# Altium schematic sheet VGA.SchDoc
size 594 x 420 mm
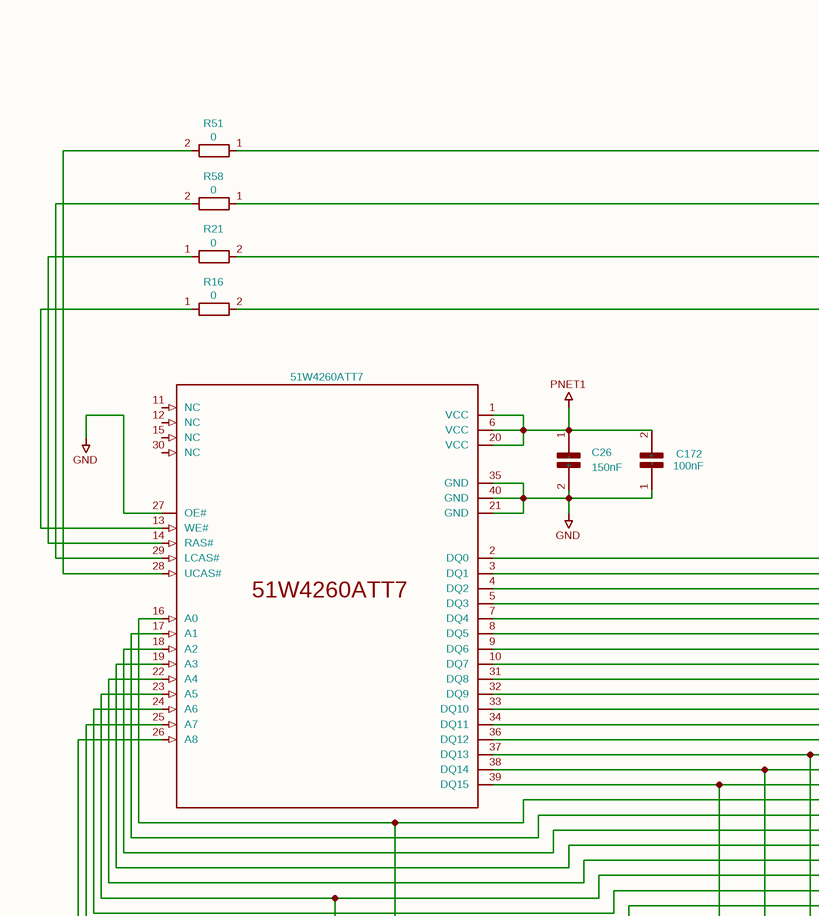
[diagram p0: VGA.SchDoc, top left]
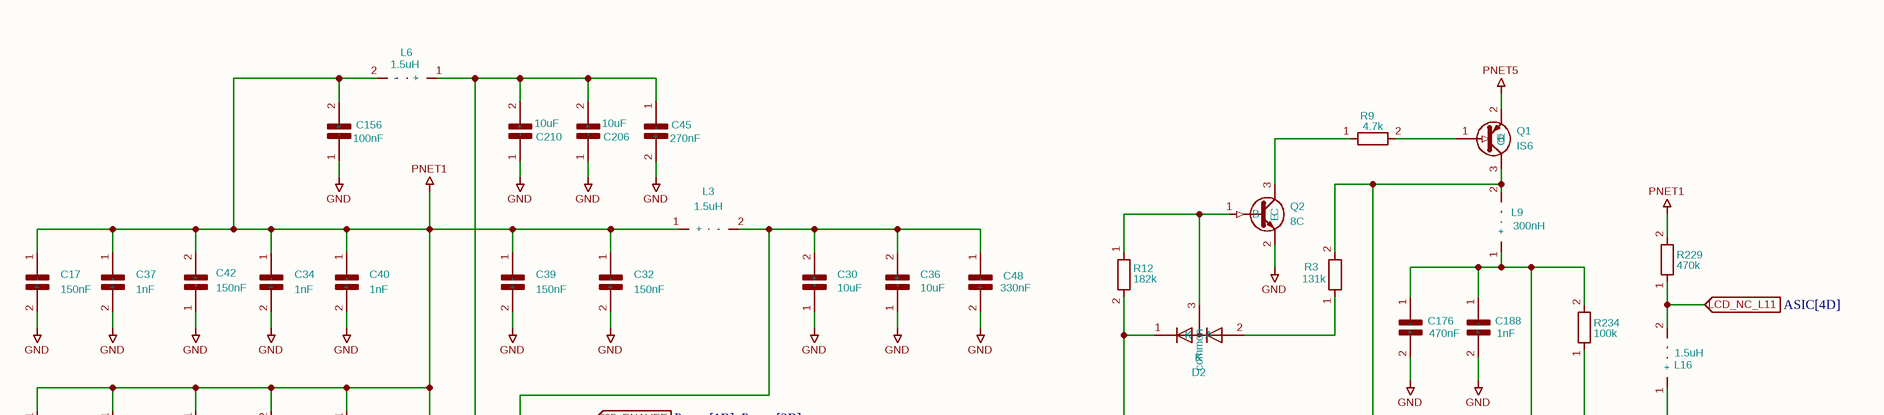
[diagram p1: VGA.SchDoc, top right]
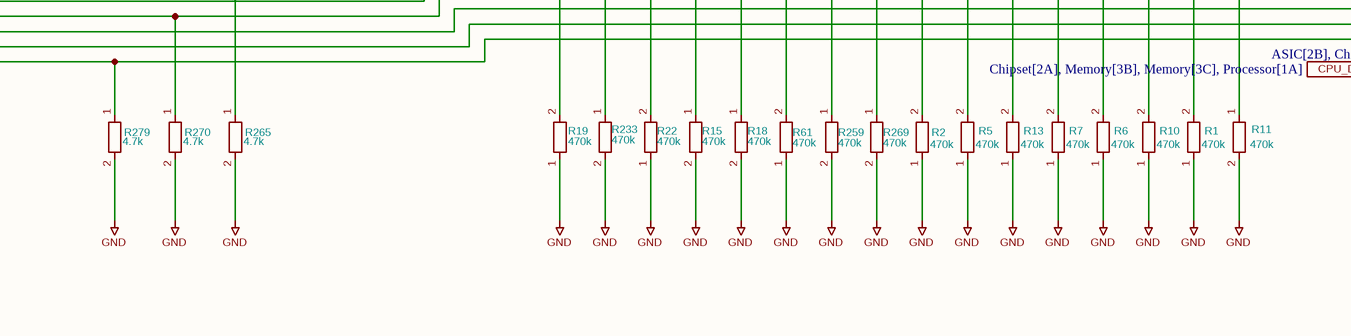
[diagram p2: VGA.SchDoc, bottom left]
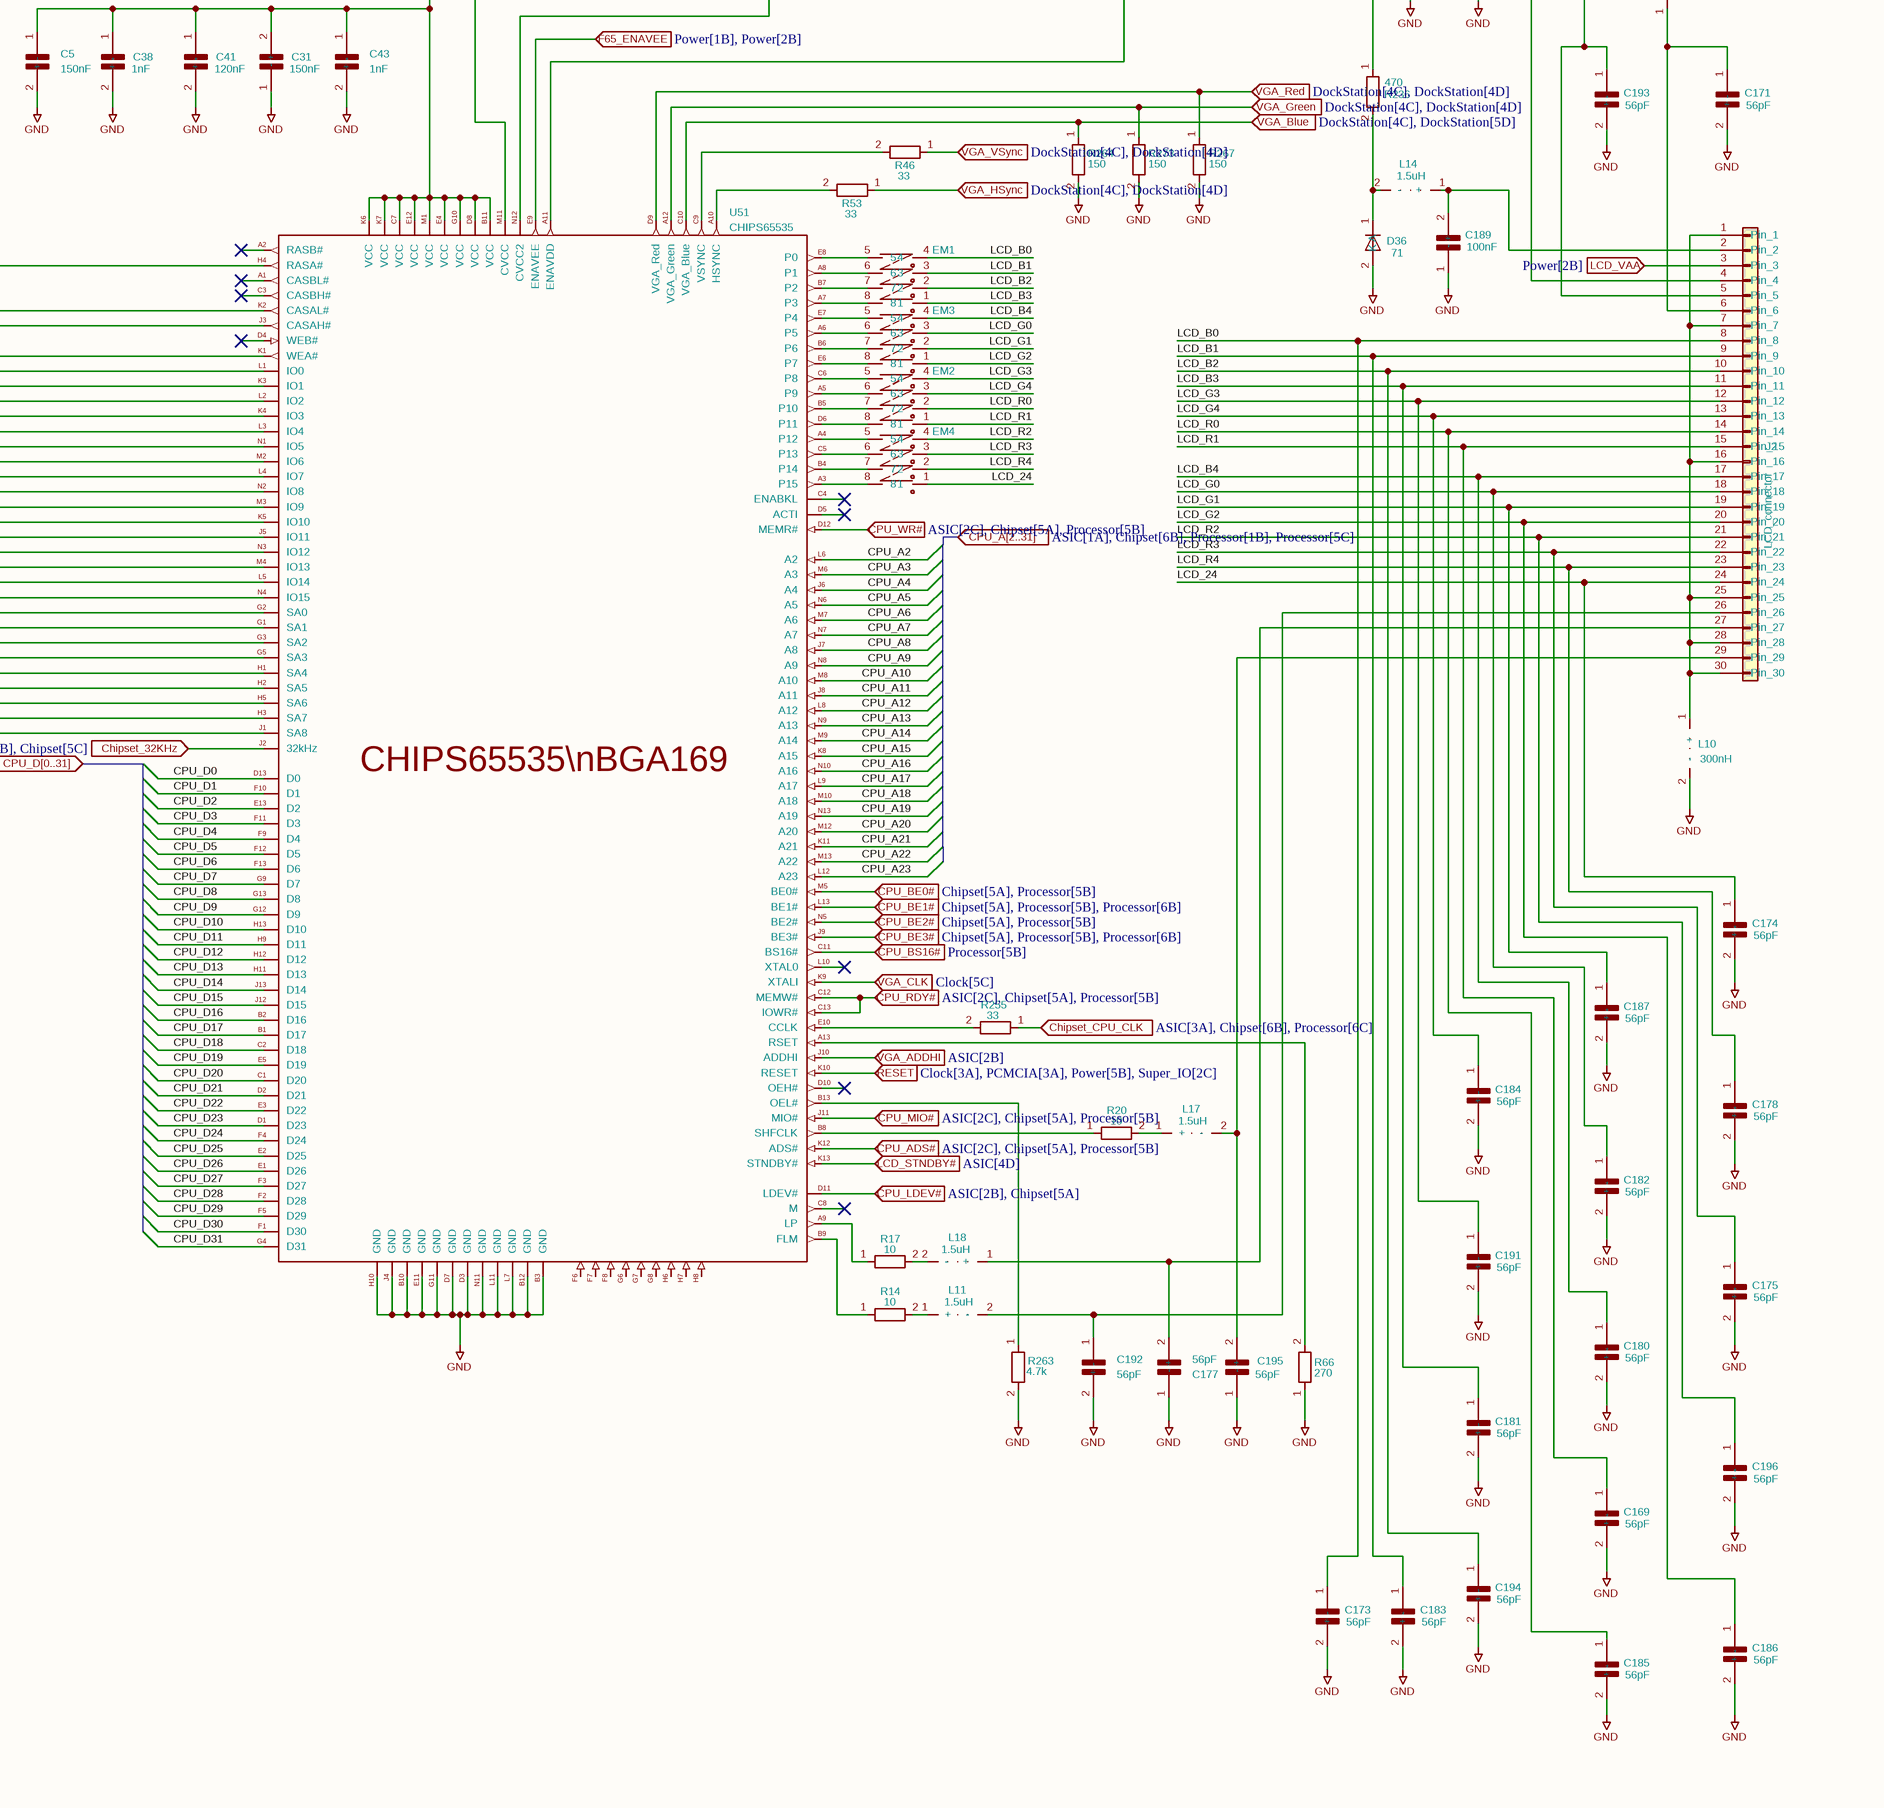
[diagram p3: VGA.SchDoc, bottom right]

## Parts
C5  150nF  [C_0402_1005Metric]
C17  150nF  [C_0402_1005Metric]
C26  150nF  [C_0402_1005Metric]
C30  10uF  [C_1206_3216Metric]
C31  150nF  [C_0402_1005Metric]
C32  150nF  [C_0402_1005Metric]
C34  1nF  [C_0402_1005Metric]
C36  10uF  [C_1206_3216Metric]
C37  1nF  [C_0402_1005Metric]
C38  1nF  [C_0402_1005Metric]
C39  150nF  [C_0402_1005Metric]
C40  1nF  [C_0402_1005Metric]
C41  120nF  [C_0402_1005Metric]
C42  150nF  [C_0402_1005Metric]
C43  1nF  [C_0402_1005Metric]
C45  270nF  [C_0603_1608Metric]
C48  330nF  [C_0402_1005Metric]
C156  100nF  [C_0402_1005Metric]
C169  56pF  [C_0402_1005Metric]
C171  56pF  [C_0402_1005Metric]
C172  100nF  [C_0402_1005Metric]
C173  56pF  [C_0402_1005Metric]
C174  56pF  [C_0402_1005Metric]
C175  56pF  [C_0402_1005Metric]
C176  470nF  [C_0603_1608Metric]
C177  56pF  [C_0402_1005Metric]
C178  56pF  [C_0402_1005Metric]
C180  56pF  [C_0402_1005Metric]
C181  56pF  [C_0402_1005Metric]
C182  56pF  [C_0402_1005Metric]
C183  56pF  [C_0402_1005Metric]
C184  56pF  [C_0402_1005Metric]
C185  56pF  [C_0402_1005Metric]
C186  56pF  [C_0402_1005Metric]
C187  56pF  [C_0402_1005Metric]
C188  1nF  [C_0402_1005Metric]
C189  100nF  [C_0402_1005Metric]
C191  56pF  [C_0402_1005Metric]
C192  56pF  [C_0402_1005Metric]
C193  56pF  [C_0402_1005Metric]
C194  56pF  [C_0402_1005Metric]
C195  56pF  [C_0402_1005Metric]
C196  56pF  [C_0402_1005Metric]
C206  10uF  [C_1206_3216Metric]
C210  10uF  [C_1206_3216Metric]
D2  K  [SOT-416L]
D36  71  [D_0603_1608Metric]
EM1  R-array  [R-array]  (value not drawn)
EM2  R-array  [R-array]  (value not drawn)
EM3  R-array  [R-array]  (value not drawn)
EM4  R-array  [R-array]  (value not drawn)
J2  LCD_connector  [LCD_connector]
L3  1.5uH  [L_0603_1608Metric]
L6  1.5uH  [L_0603_1608Metric]
L9  300nH  [L_0805_2012Metric]
L10  300nH  [L_0805_2012Metric]
L11  1.5uH  [L_0603_1608Metric]
L14  1.5uH  [L_0603_1608Metric]
L16  1.5uH  [L_0603_1608Metric]
L17  1.5uH  [L_0603_1608Metric]
L18  1.5uH  [L_0603_1608Metric]
Q1  IS6  [SOT-23]
Q2  8C  [SOT-416]
R1  470k  [R_0402_1005Metric]
R2  470k  [R_0402_1005Metric]
R3  131k  [R_0402_1005Metric]
R5  470k  [R_0402_1005Metric]
R6  470k  [R_0402_1005Metric]
R7  470k  [R_0402_1005Metric]
R9  4.7k  [R_0402_1005Metric]
R10  470k  [R_0402_1005Metric]
R11  470k  [R_0402_1005Metric]
R12  182k  [R_0402_1005Metric]
R13  470k  [R_0402_1005Metric]
R14  10  [R_0402_1005Metric]
R15  470k  [R_0402_1005Metric]
R16  0  [R_0402_1005Metric]
R17  10  [R_0402_1005Metric]
R18  470k  [R_0402_1005Metric]
R19  470k  [R_0402_1005Metric]
R20  10  [R_0402_1005Metric]
R21  0  [R_0402_1005Metric]
R22  470k  [R_0402_1005Metric]
R46  33  [R_0402_1005Metric]
R51  0  [R_0402_1005Metric]
R53  33  [R_0402_1005Metric]
R58  0  [R_0402_1005Metric]
R61  470k  [R_0402_1005Metric]
R66  270  [R_0402_1005Metric]
R229  470k  [R_0402_1005Metric]
R233  470k  [R_0402_1005Metric]
R234  100k  [R_0402_1005Metric]
R236  470  [R_0402_1005Metric]
R255  33  [R_0402_1005Metric]
R259  470k  [R_0402_1005Metric]
R263  4.7k  [R_0402_1005Metric]
R264  150  [R_0805_2012Metric]
R265  4.7k  [R_0402_1005Metric]
R267  150  [R_0805_2012Metric]
R269  470k  [R_0402_1005Metric]
R270  4.7k  [R_0402_1005Metric]
R273  150  [R_0805_2012Metric]
R279  4.7k  [R_0402_1005Metric]
U8  51W4260ATT7  [GRAMchip]
U51  CHIPS65535  [BGA-169]

## Ports
Chipset_32KHz (in, see ASIC[2B], Chipset[5C]), Chipset_CPU_CLK (in, see ASIC[3A], Chipset[6B], Processor[6C]), CPU_A[2..31] (in, see ASIC[1A], Chipset[6B], Processor[1B], Processor[5C]), CPU_ADS# (in, see ASIC[2C], Chipset[5A], Processor[5B]), CPU_BE0# (in, see Chipset[5A], Processor[5B]), CPU_BE1# (in, see Chipset[5A], Processor[5B], Processor[6B]), CPU_BE2# (in, see Chipset[5A], Processor[5B]), CPU_BE3# (in, see Chipset[5A], Processor[5B], Processor[6B]), CPU_BS16# (in, see Processor[5B]), CPU_D[0..31] (in, see Chipset[2A], Memory[3B], Memory[3C], Processor[1A]), CPU_LDEV# (in, see ASIC[2B], Chipset[5A]), CPU_MIO# (in, see ASIC[2C], Chipset[5A], Processor[5B]), CPU_RDY# (in, see ASIC[2C], Chipset[5A], Processor[5B]), CPU_WR# (in, see ASIC[2C], Chipset[5A], Processor[5B]), F65_ENAVEE (in, see Power[1B], Power[2B]), LCD_NC_L11 (in, see ASIC[4D]), LCD_STNDBY# (in, see ASIC[4D]), LCD_VAA (in, see Power[2B]), RESET (in, see Clock[3A], PCMCIA[3A], Power[5B], Super_IO[2C]), VGA_ADDHI (in, see ASIC[2B]), VGA_Blue (in, see DockStation[4C], DockStation[5D]), VGA_CLK (in, see Clock[5C]), VGA_Green (in, see DockStation[4C], DockStation[4D]), VGA_HSync (in, see DockStation[4C], DockStation[4D]), VGA_Red (in, see DockStation[4C], DockStation[4D]), VGA_VSync (in, see DockStation[4C], DockStation[4D])

## Nets
GND: C5.2(-) C17.2(-) C26.2(-) C30.1(+) C31.1(+) C32.2(-) C34.2(-) C36.1(+) C37.2(-) C38.2(-) C39.2(-) C40.2(-) C41.2(-) C42.1(+) C43.2(-) C45.2(-) C48.2(-) C156.1(+) C169.2(-) C171.2(-) C172.1(+) C173.2(-) C174.2(-) C175.2(-) C176.2(-) C177.1(+) C178.2(-) C180.2(-) C181.2(-) C182.2(-) C183.2(-) C184.2(-) C185.2(-) C186.2(-) C187.2(-) C188.2(-) C189.1(+) C191.2(-) C192.2(-) C193.2(-) C194.2(-) C195.1(+) C196.2(-) C206.1(+) C210.1(+) D36.2(A) L10.2(-) Q2.2(E) R1.1 R2.1 R5.1 R6.1 R7.1 R10.1 R11.2 R13.1 R15.2 R18.2 R19.1 R22.1 R61.1 R66.1 R233.2 R259.2 R263.2 R264.2 R265.2 R267.2 R269.2 R270.2 R273.2 R279.2 U8.21(GND) U8.27(OE#) U8.35(GND) U8.40(GND) U51.B3(GND) U51.B10(GND) U51.B12(GND) U51.D3(GND) U51.D7(GND) U51.E11(GND) U51.G11(GND) U51.H10(GND) U51.J4(GND) U51.L7(GND) U51.L11(GND) U51.N11(GND)
PNET1: C5.1(+) C17.1(+) C26.1(+) C31.2(-) C32.1(+) C34.1(+) C37.1(+) C38.1(+) C39.1(+) C40.1(+) C41.1(+) C42.2(-) C43.1(+) C156.2(-) C172.2(-) L3.1(+) L6.2(-) R229.2 U8.1(VCC) U8.6(VCC) U8.20(VCC) U51.B11(VCC) U51.C7(VCC) U51.D8(VCC) U51.E4(VCC) U51.E12(VCC) U51.G10(VCC) U51.K6(VCC) U51.K7(VCC) U51.M1(VCC)
PNET5: Q1.2(E)
Chipset_32KHz: U51.J2(32kHz) ; port Chipset_32KHz
Chipset_CPU_CLK: R255.1 ; port Chipset_CPU_CLK
CPU_A2: U51.L6(A2)
CPU_A3: U51.M6(A3)
CPU_A4: U51.J6(A4)
CPU_A5: U51.N6(A5)
CPU_A6: U51.M7(A6)
CPU_A7: U51.N7(A7)
CPU_A8: U51.J7(A8)
CPU_A9: U51.N8(A9)
CPU_A10: U51.M8(A10)
CPU_A11: U51.J8(A11)
CPU_A12: U51.L8(A12)
CPU_A13: U51.N9(A13)
CPU_A14: U51.M9(A14)
CPU_A15: U51.K8(A15)
CPU_A16: U51.N10(A16)
CPU_A17: U51.L9(A17)
CPU_A18: U51.M10(A18)
CPU_A19: U51.N13(A19)
CPU_A20: U51.M12(A20)
CPU_A21: U51.K11(A21)
CPU_A22: U51.M13(A22)
CPU_A23: U51.L12(A23)
CPU_ADS#: U51.K12(ADS#) ; port CPU_ADS#
CPU_BE0#: U51.M5(BE0#) ; port CPU_BE0#
CPU_BE1#: U51.L13(BE1#) ; port CPU_BE1#
CPU_BE2#: U51.N5(BE2#) ; port CPU_BE2#
CPU_BE3#: U51.J9(BE3#) ; port CPU_BE3#
CPU_BS16#: U51.C11(BS16#) ; port CPU_BS16#
CPU_D0: U51.D13(D0)
CPU_D1: U51.F10(D1)
CPU_D2: U51.E13(D2)
CPU_D3: U51.F11(D3)
CPU_D4: U51.F9(D4)
CPU_D5: U51.F12(D5)
CPU_D6: U51.F13(D6)
CPU_D7: U51.G9(D7)
CPU_D8: U51.G13(D8)
CPU_D9: U51.G12(D9)
CPU_D10: U51.H13(D10)
CPU_D11: U51.H9(D11)
CPU_D12: U51.H12(D12)
CPU_D13: U51.H11(D13)
CPU_D14: U51.J13(D14)
CPU_D15: U51.J12(D15)
CPU_D16: U51.B2(D16)
CPU_D17: U51.B1(D17)
CPU_D18: U51.C2(D18)
CPU_D19: U51.E5(D19)
CPU_D20: U51.C1(D20)
CPU_D21: U51.D2(D21)
CPU_D22: U51.E3(D22)
CPU_D23: U51.D1(D23)
CPU_D24: U51.F4(D24)
CPU_D25: U51.E2(D25)
CPU_D26: U51.E1(D26)
CPU_D27: U51.F3(D27)
CPU_D28: U51.F2(D28)
CPU_D29: U51.F5(D29)
CPU_D30: U51.F1(D30)
CPU_D31: U51.G4(D31)
CPU_LDEV#: U51.D11(LDEV#) ; port CPU_LDEV#
CPU_MIO#: U51.J11(MIO#) ; port CPU_MIO#
CPU_RDY#: U51.C12(MEMW#) U51.C13(IOWR#) ; port CPU_RDY#
CPU_WR#: U51.D12(MEMR#) ; port CPU_WR#
F65_ENAVEE: U51.E9(ENAVEE) ; port F65_ENAVEE
LCD_24: C174.1(+) EM4.1 J2.24(Pin_24)
LCD_B0: C173.1(+) EM1.4 J2.8(Pin_8)
LCD_B1: C183.1(+) EM1.3 J2.9(Pin_9)
LCD_B2: C194.1(+) EM1.2 J2.10(Pin_10)
LCD_B3: C181.1(+) EM1.1 J2.11(Pin_11)
LCD_B4: C180.1(+) EM3.4 J2.17(Pin_17)
LCD_G0: C182.1(+) EM3.3 J2.18(Pin_18)
LCD_G1: C187.1(+) EM3.2 J2.19(Pin_19)
LCD_G2: C186.1(+) EM3.1 J2.20(Pin_20)
LCD_G3: C191.1(+) EM2.4 J2.12(Pin_12)
LCD_G4: C184.1(+) EM2.3 J2.13(Pin_13)
LCD_NC_L11: L16.2(-) R229.1 ; port LCD_NC_L11
LCD_R0: C185.1(+) EM2.2 J2.14(Pin_14)
LCD_R1: C169.1(+) EM2.1 J2.15(Pin_15)
LCD_R2: C196.1(+) EM4.4 J2.21(Pin_21)
LCD_R3: C175.1(+) EM4.3 J2.22(Pin_22)
LCD_R4: C178.1(+) EM4.2 J2.23(Pin_23)
LCD_STNDBY#: U51.K13(STNDBY#) ; port LCD_STNDBY#
LCD_VAA: J2.3(Pin_3) ; port LCD_VAA
RESET: U51.K10(RESET) ; port RESET
VGA_ADDHI: U51.J10(ADDHI) ; port VGA_ADDHI
VGA_Blue: R264.1 U51.C10(VGA_Blue) ; port VGA_Blue
VGA_CLK: U51.K9(XTALI) ; port VGA_CLK
VGA_Green: R273.1 U51.A12(VGA_Green) ; port VGA_Green
VGA_HSync: R53.1 ; port VGA_HSync
VGA_Red: R267.1 U51.D9(VGA_Red) ; port VGA_Red
VGA_VSync: R46.1 ; port VGA_VSync
NetC30_2: C30.2(-) C36.2(-) C48.1(+) L3.2(-) U51.N12(CVCC2)
NetC45_1: C45.1(+) C206.2(-) C210.2(-) L6.1(+) U51.M11(CVCC)
NetC171_1: C171.1(+) J2.6(Pin_6) L16.1(+)
NetC176_1: C176.1(+) C188.1(+) J2.4(Pin_4) L9.1(+) R234.2
NetC177_2: C177.2(-) J2.27(Pin_27) L18.1(+)
NetC189_2: C189.2(-) J2.2(Pin_2) L14.1(+)
NetC192_1: C192.1(+) J2.26(Pin_26) L11.2(-)
NetC193_1: C193.1(+) J2.5(Pin_5) R234.1
NetC195_2: C195.2(-) J2.29(Pin_29) L17.2(-)
NetD2_1: D2.1(K) R12.2 U51.A11(ENAVDD)
NetD2_2: D2.2(A) R3.1
NetD2_3: D2.3(common) Q2.1(B) R12.1
NetD36_1: D36.1(K) L14.2(-) R236.2
NetEM1_5: EM1.5 U51.E8(P0)
NetEM1_6: EM1.6 U51.A8(P1)
NetEM1_7: EM1.7 U51.B7(P2)
NetEM1_8: EM1.8 U51.A7(P3)
NetEM2_5: EM2.5 U51.C6(P8)
NetEM2_6: EM2.6 U51.A5(P9)
NetEM2_7: EM2.7 U51.B5(P10)
NetEM2_8: EM2.8 U51.D6(P11)
NetEM3_5: EM3.5 U51.E7(P4)
NetEM3_6: EM3.6 U51.A6(P5)
NetEM3_7: EM3.7 U51.B6(P6)
NetEM3_8: EM3.8 U51.E6(P7)
NetEM4_5: EM4.5 U51.A4(P12)
NetEM4_6: EM4.6 U51.C5(P13)
NetEM4_7: EM4.7 U51.B4(P14)
NetEM4_8: EM4.8 U51.A3(P15)
NetJ2_1: J2.1(Pin_1) J2.7(Pin_7) J2.16(Pin_16) J2.25(Pin_25) J2.28(Pin_28) J2.30(Pin_30) L10.1(+)
NetL9_2: L9.2(-) Q1.3(C) R3.2 R236.1
NetL11_1: L11.1(+) R14.2
NetL17_1: L17.1(+) R20.2
NetL18_2: L18.2(-) R17.2
NetQ1_1: Q1.1(B) R9.2
NetQ2_3: Q2.3(C) R9.1
NetR1_2: R1.2 U8.3(DQ1) U51.K3(IO1)
NetR2_2: R2.2 U8.10(DQ7) U51.L4(IO7)
NetR5_2: R5.2 U8.9(DQ6) U51.M2(IO6)
NetR6_2: R6.2 U8.5(DQ3) U51.K4(IO3)
NetR7_2: R7.2 U8.7(DQ4) U51.L3(IO4)
NetR10_2: R10.2 U8.4(DQ2) U51.L2(IO2)
NetR11_1: R11.1 U8.2(DQ0) U51.L1(IO0)
NetR13_2: R13.2 U8.8(DQ5) U51.N1(IO5)
NetR14_1: R14.1 U51.B9(FLM)
NetR15_1: R15.1 U8.36(DQ12) U51.N3(IO12)
NetR16_1: R16.1 U8.13(WE#)
NetR16_2: R16.2 U51.K1(WEA#)
NetR17_1: R17.1 U51.A9(LP)
NetR18_1: R18.1 U8.34(DQ11) U51.J5(IO11)
NetR19_2: R19.2 U8.39(DQ15) U51.N4(IO15)
NetR20_1: R20.1 U51.B8(SHFCLK)
NetR21_1: R21.1 U8.14(RAS#)
NetR21_2: R21.2 U51.H4(RASA#)
NetR22_2: R22.2 U8.37(DQ13) U51.M4(IO13)
NetR46_2: R46.2 U51.C9(VSYNC)
NetR51_1: R51.1 U51.J3(CASAH#)
NetR51_2: R51.2 U8.28(UCAS#)
NetR53_2: R53.2 U51.A10(HSYNC)
NetR58_1: R58.1 U51.K2(CASAL#)
NetR58_2: R58.2 U8.29(LCAS#)
NetR61_2: R61.2 U8.33(DQ10) U51.K5(IO10)
NetR66_2: R66.2 U51.A13(RSET)
NetR233_1: R233.1 U8.38(DQ14) U51.L5(IO14)
NetR255_2: R255.2 U51.E10(CCLK)
NetR259_1: R259.1 U8.32(DQ9) U51.M3(IO9)
NetR263_1: R263.1 U51.B13(OEL#)
NetR265_1: R265.1 U8.16(A0) U51.G2(SA0)
NetR269_1: R269.1 U8.31(DQ8) U51.N2(IO8)
NetR270_1: R270.1 U8.23(A5) U51.H2(SA5)
NetR279_1: R279.1 U8.26(A8) U51.J1(SA8)
NetU8_17: U8.17(A1) U51.G1(SA1)
NetU8_18: U8.18(A2) U51.G3(SA2)
NetU8_19: U8.19(A3) U51.G5(SA3)
NetU8_22: U8.22(A4) U51.H1(SA4)
NetU8_24: U8.24(A6) U51.H5(SA6)
NetU8_25: U8.25(A7) U51.H3(SA7)

Not connected (* = marked no-connect by the designer): U8 11(NC) 12(NC) 15(NC) 30(NC); U51 A1(CASBL#)* A2(RASB#)* C3(CASBH#)* C4(ENABKL)* C8(M)* D4(WEB#)* D5(ACTI)* D10(OEH#)* F6 F7 F8 G6 G7 G8 H6 H7 H8 L10(XTAL0)*

## Notes on the sheet
- 1
- 2
- 3
- 4
- 5
- 6
- 7
- 8
- 9
- 10
- 11
- A
- B
- C
- D
- E
- F
- G
- H
- Title: PC110
- File: VGA.kicad_sch
- Sheet: /
- Recreated by: Ahmad Byagowi
- KiCad E.D.A.  kicad (5.1.4)-1
- Size: A2
- Date:
- Rev:
- Id: 1/1
- (in symbol 65535) CHIPS65535\nBGA169

## Library data of the parts
C5 C17 C26 C30-C32 C34 C36-C43 C45 C48 C156 C169 C171-C178 C180-C189 C191-C196 C206 C210 = C
  C5 C17 C26 C31 C32 C39 C42: Value: 150nF; Footprint: Capacitor_SMD:C_0402_1005Metric
  C30 C36 C206 C210: Value: 10uF; Footprint: Capacitor_SMD:C_1206_3216Metric
  C34 C37 C38 C40 C43 C188: Value: 1nF; Footprint: Capacitor_SMD:C_0402_1005Metric
  C41: Value: 120nF; Footprint: Capacitor_SMD:C_0402_1005Metric
  C45: Value: 270nF; Footprint: Capacitor_SMD:C_0603_1608Metric
  C48: Value: 330nF; Footprint: Capacitor_SMD:C_0402_1005Metric
  C156 C172 C189: Value: 100nF; Footprint: Capacitor_SMD:C_0402_1005Metric
  C169 C171 C173-C175 C177 C178 C180-C187 C191-C196: Value: 56pF; Footprint: Capacitor_SMD:C_0402_1005Metric
  C176: Value: 470nF; Footprint: Capacitor_SMD:C_0603_1608Metric
D2 = D_Dual_Series_KAC: Value: K; Footprint: PC110:SOT-416L
D36 = D: Value: 71; Footprint: Diode_SMD:D_0603_1608Metric
EM1 = EMI_filter_Array: Value: R-array; Footprint: PC110:R-array
EM2 = EMI_filter_Array_2: Value: R-array; Footprint: PC110:R-array
EM3 = EMI_filter_Array_1: Value: R-array; Footprint: PC110:R-array
EM4 = EMI_filter_Array_3: Value: R-array; Footprint: PC110:R-array
J2 = Conn_01x30: Value: LCD_connector; Footprint: PC110:LCD_connector
L3 L6 L9-L11 L14 L16-L18 = L
  L3 L6 L11 L14 L16-L18: Value: 1.5uH; Footprint: Inductor_SMD:L_0603_1608Metric
  L9 L10: Value: 300nH; Footprint: Inductor_SMD:L_0805_2012Metric
Q1 = Q_PNP_Generic_BEC: Value: IS6; Footprint: PCM_Package_TO_SOT_SMD_AKL:SOT-23
Q2 = MMBTA44: Value: 8C; Footprint: Package_TO_SOT_SMD:SOT-416
R1-R3 R5-R7 R9-R22 R46 R51 R53 R58 R61 R66 R229 R233 R234 R236 R255 R259 R263-R265 R267 R269 R270 R273 R279 = R
  R1 R2 R5-R7 R10 R11 R13 R15 R18 R19 R22 R61 R229 R233 R259 R269: Value: 470k; Footprint: PCM_Resistor_SMD_AKL:R_0402_1005Metric
  R3: Value: 131k; Footprint: PCM_Resistor_SMD_AKL:R_0402_1005Metric
  R9 R263 R265 R270 R279: Value: 4.7k; Footprint: PCM_Resistor_SMD_AKL:R_0402_1005Metric
  R12: Value: 182k; Footprint: PCM_Resistor_SMD_AKL:R_0402_1005Metric
  R14 R17 R20: Value: 10; Footprint: PCM_Resistor_SMD_AKL:R_0402_1005Metric
  R16 R21 R51 R58: Value: 0; Footprint: PCM_Resistor_SMD_AKL:R_0402_1005Metric
  R46 R53 R255: Value: 33; Footprint: PCM_Resistor_SMD_AKL:R_0402_1005Metric
  R66: Value: 270; Footprint: PCM_Resistor_SMD_AKL:R_0402_1005Metric
  R234: Value: 100k; Footprint: PCM_Resistor_SMD_AKL:R_0402_1005Metric
  R236: Value: 470; Footprint: PCM_Resistor_SMD_AKL:R_0402_1005Metric
  R264 R267 R273: Value: 150; Footprint: PCM_Resistor_SMD_AKL:R_0805_2012Metric
U8 = 51W4260: Value: 51W4260ATT7; Footprint: PC110:GRAMchip
U51 = 65535: Value: CHIPS65535; Footprint: PC110:BGA-169